# Altium schematic sheet 移动扫码模块.SchDoc
size A4
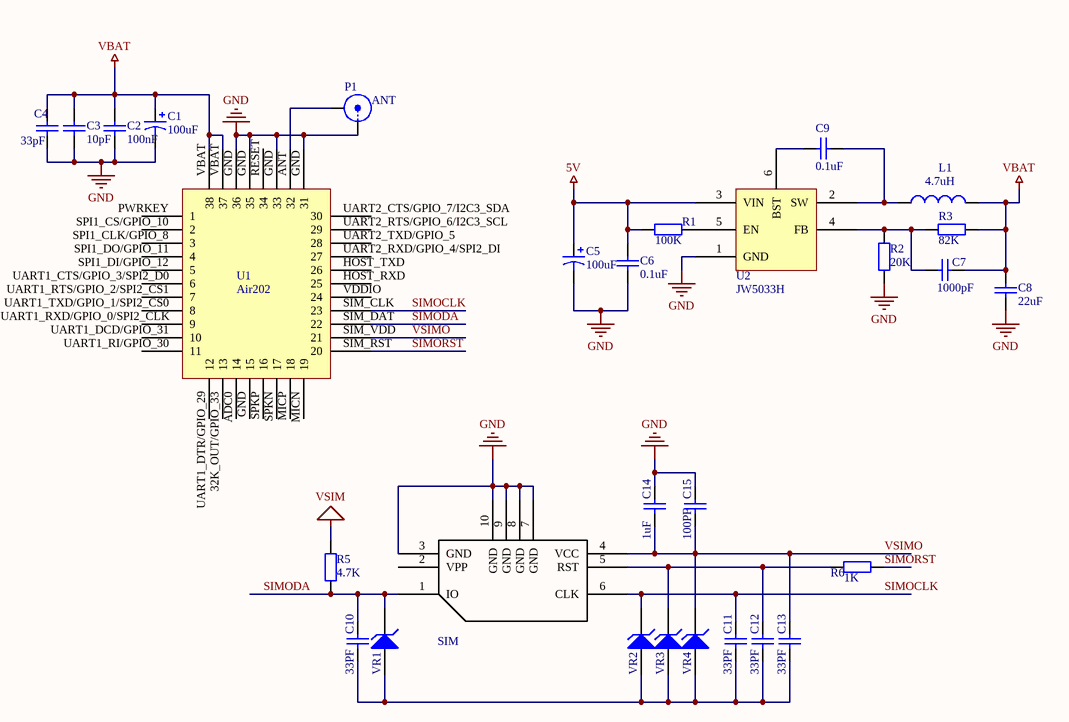
[diagram p0: 移动扫码模块.SchDoc]

## Parts
C1  value 100uF  [RB7.6-15]  (hidden comment: Cap Pol1)
C2  value 100nF  [RAD-0.3]  (hidden comment: Cap)
C3  value 10pF  [RAD-0.3]  (hidden comment: Cap)
C4  value 33pF  [RAD-0.3]  (hidden comment: Cap)
C5  value 100uF  [RB7.6-15]  (hidden comment: Cap Pol1)
C6  value 0.1uF  [RAD-0.3]  (hidden comment: Cap)
C7  value 1000pF  [RAD-0.3]  (hidden comment: Cap)
C8  value 22uF  [RAD-0.3]  (hidden comment: Cap)
C9  value 0.1uF  [RAD-0.3]  (hidden comment: Cap)
C10  value 33PF  [RAD-0.3]  (hidden comment: Cap)
C11  value 33PF  [RAD-0.3]  (hidden comment: Cap)
C12  value 33PF  [RAD-0.3]  (hidden comment: Cap)
C13  value 33PF  [RAD-0.3]  (hidden comment: Cap)
C14  value 1uF  [RAD-0.3]  (hidden comment: Cap)
C15  value 100PF  [RAD-0.3]  (hidden comment: Cap)
L1  value 4.7uH  [0402-A]  (hidden comment: Inductor)
P1  ANT  [BNC_RA CON]
R1  value 100K  [AXIAL-0.4]  (hidden comment: Res2)
R2  value 20K  [AXIAL-0.4]  (hidden comment: Res2)
R3  value 82K  [AXIAL-0.4]  (hidden comment: Res2)
R5  value 4.7K  [AXIAL-0.4]  (hidden comment: Res2)
R6  value 1K  [AXIAL-0.4]  (hidden comment: Res2)
SIM  NB  (value not drawn)
U1  Air202
U2  JW5033H
VR1  D Zener  [DIODE-0.7]  (value not drawn)
VR2  D Zener  [DIODE-0.7]  (value not drawn)
VR3  D Zener  [DIODE-0.7]  (value not drawn)
VR4  D Zener  [DIODE-0.7]  (value not drawn)

## Nets
5V: C5.1 C6.2 R1.1 U2.3(VIN)
GND: C1.2 C2.1 C3.1 C4.1 C5.2 C6.1 C8.2 C14.2 C15.2 P1.1(X) R2.2 SIM.3(GND) SIM.7(GND) SIM.8(GND) SIM.9(GND) SIM.10(GND) U1.GND(15) U2.1(GND)
VBAT: C1.1 C2.2 C3.2 C4.2 C7.1 C8.1 L1.2 R3.2 U1.VBAT(37)
VSIM: R5.2
SIMOCLK: C11.2 SIM.6(CLK) U1.SIM_CLK(23) VR2.2(K)
SIMODA: C10.2 R5.1 SIM.1(IO) U1.SIM_DAT(22) VR1.2(K)
SIMORST: R6.1 U1.SIM_RST(20)
VSIMO: C13.2 C14.1 C15.1 SIM.4(VCC) U1.SIM_VDD(21) VR4.2(K)
NetC7_2: C7.2 R2.1 R3.1 U2.4(FB)
NetC9_1: C9.1 U2.6(BST)
NetC9_2: C9.2 L1.1 U2.2(SW)
NetC10_1: C10.1 C11.1 C12.1 C13.1 VR1.1(A) VR2.1(A) VR3.1(A) VR4.1(A)
NetC12_2: C12.2 R6.2 SIM.5(RST) VR3.2(K)
NetP1_2: P1.2(Y) U1.ANT(32)
NetR1_2: R1.2 U2.5(EN)

Not connected (* = marked no-connect by the designer): SIM 2(VPP); U1 32K_OUT/GPIO_33(13) ADC0(14) HOST_RXD(25) HOST_TXD(26) MICN(19) MICP(18) PWRKEY(1) RESET(34) SPI1_CLK/GPIO_8(3) SPI1_CS/GPIO_10(2) SPI1_DI/GPIO_12(5) SPI1_DO/GPIO_11(4) SPKN(17) SPKP(16) UART1_CTS/GPIO_3/SPI2_D0(6) UART1_DCD/GPIO_31(10) UART1_DTR/GPIO_29(12) UART1_RI/GPIO_30(11) UART1_RTS/GPIO_2/SPI2_CS1(7) UART1_RXD/GPIO_0/SPI2_CLK(9) UART1_TXD/GPIO_1/SPI2_CS0(8) UART2_CTS/GPIO_7/I2C3_SDA(30) UART2_RTS/GPIO_6/I2C3_SCL(29) UART2_RXD/GPIO_4/SPI2_DI(27) UART2_TXD/GPIO_5(28) VDDIO(24)

## Library data of the parts
C1 C5 = Cap Pol1: Polarized Capacitor (Radial); Published: 8-Jun-2000; LatestRevisionDate: 17-Jul-2002; LatestRevisionNote: Re-released for DXP Platform.; PackageReference: RB7.6-15; Publisher: Altium Limited; PackageDescription: Polarized Capacitor (Radial); 2 Leads
C2-C4 C6-C15 = Cap: Capacitor; Published: 8-Jun-2000; LatestRevisionDate: 17-Jul-2002; LatestRevisionNote: Re-released for DXP Platform.; PackageReference: RAD-0.3; Publisher: Altium Limited; PackageDescription: Radial Cap, Thru-Hole; 2 Leads; 0.3 in Pin Spacing
L1 = Inductor: Code_IEC: 1005; Published: 8-Jun-2000; LatestRevisionDate: 29-May-2009; LatestRevisionNote: IPC-7351 Footprint Added.; PackageReference: 0402-A; Publisher: Altium Limited; PackageDescription: Chip Inductor; Code_JEITA: 0402
P1 = BNC: BNC Elbow Connector; LatestRevisionDate: 17-Jul-2002; LatestRevisionNote: Re-released for DXP Platform.; Publisher: Altium Limited
R1-R3 R5 R6 = Res2: Resistor; Published: 8-Jun-2000; LatestRevisionDate: 17-Jul-2002; LatestRevisionNote: Re-released for DXP Platform.; PackageReference: AXIAL-0.4; Publisher: Altium Limited; PackageDescription: Axial Device, Thru-Hole; 2 Leads; 0.4 in Pin Spacing
U1 = Component_1
VR1-VR4 = D Zener: Zener Diode; Published: 8-Jun-2000; LatestRevisionDate: 17-Jul-2002; LatestRevisionNote: Re-released for DXP Platform.; PackageReference: DIODE-0.7; Publisher: Altium Limited; PackageDescription: Diode, Thru-Hole; 2 Leads; 0.7 in Pin Spacing